# Altium schematic sheet External Flash.SchDoc
size A
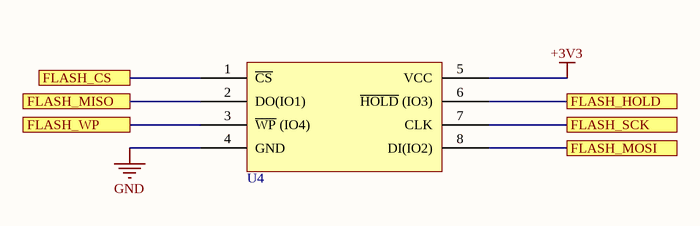
[diagram p0: External Flash.SchDoc]

## Parts
U4  W25Q128  [SOIC-8]  (value not drawn)

## Ports
FLASH_CS, FLASH_HOLD, FLASH_MISO, FLASH_MOSI, FLASH_SCK, FLASH_WP

## Nets
+3V3: U4.5(VCC)
GND: U4.4(GND)
FLASH_CS: U4.1(~{CS}) ; port FLASH_CS
FLASH_HOLD: U4.6(~{HOLD}_(IO3)) ; port FLASH_HOLD
FLASH_MISO: U4.2(DO(IO1)) ; port FLASH_MISO
FLASH_MOSI: U4.8(DI(IO2)) ; port FLASH_MOSI
FLASH_SCK: U4.7(CLK) ; port FLASH_SCK
FLASH_WP: U4.3(~{WP}_(IO4)) ; port FLASH_WP

## Library data of the parts
U4 = W25Q128: 3V 128M-BIT / SERIAL FLASH MEMORY WITH / DUAL/QUAD SP